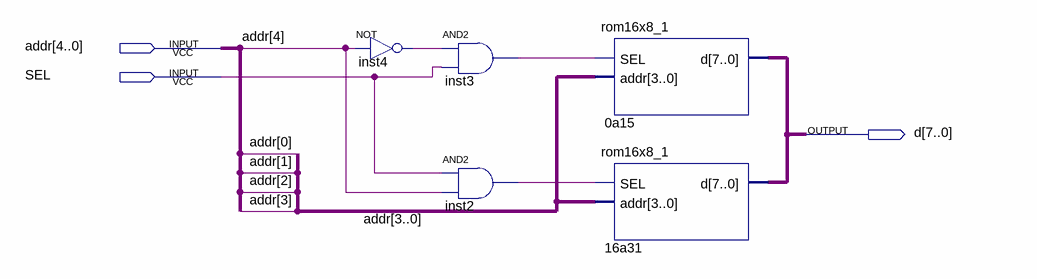
[diagram p0: schematic sheet]
// Quartus schematic rom32x8_1.bdf as structural Verilog: 5 symbols, 3 pins
module rom32x8_1 (
  input  [4:0] addr,
  input  SEL,
  output [7:0] d
);

  wire inst2_out, inst3_out, inst4_out;

  not inst4 (inst4_out, addr[4]);
  and inst3 (inst3_out, inst4_out, SEL);
  and inst2 (inst2_out, SEL, addr[4]);
  rom16x8_1 u_0a15 (.SEL(inst3_out), .addr(addr[3:0]), .d(d));
  rom16x8_1 u_16a31 (.SEL(inst2_out), .addr(addr[3:0]), .d(d));
endmodule
